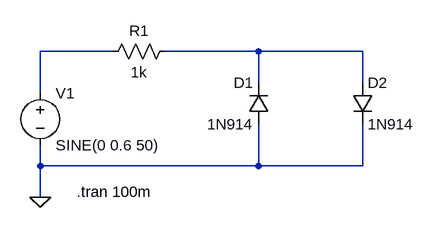
[diagram p0: schematic lab2_obmezhuvach_naprugi.asc]
lab2_obmezhuvach_naprugi.asc, the LTspice schematic file:
Version 4
SHEET 1 880 680
WIRE 96 48 -16 48
WIRE 320 48 176 48
WIRE 480 48 320 48
WIRE 320 96 320 48
WIRE 480 96 480 48
WIRE -16 112 -16 48
WIRE -16 224 -16 192
WIRE 320 224 320 160
WIRE 320 224 -16 224
WIRE 480 224 480 160
WIRE 480 224 320 224
WIRE -16 272 -16 224
FLAG -16 272 0
SYMBOL voltage -16 96 R0
WINDOW 123 0 0 Left 2
WINDOW 39 0 0 Left 2
SYMATTR InstName V1
SYMATTR Value SINE(0 0.6 50)
SYMBOL res 192 32 R90
WINDOW 0 0 56 VBottom 2
WINDOW 3 32 56 VTop 2
SYMATTR InstName R1
SYMATTR Value 1k
SYMBOL diode 336 160 R180
WINDOW 0 24 64 Left 2
WINDOW 3 24 0 Left 2
SYMATTR InstName D1
SYMATTR Value 1N914
SYMBOL diode 464 96 R0
SYMATTR InstName D2
SYMATTR Value 1N914
TEXT 40 264 Left 2 !.tran 100m

The netlist it stands for:
* lab2_obmezhuvach_naprugi.asc
V1 N001 0 SINE(0 0.6 50)
R1 N002 N001 1k
D1 0 N002 1N914
D2 N002 0 1N914
.model D D
.lib standard.dio
.tran 100m
.backanno
.end